# EAGLE schematic eCog_Buses_Template (EAGLE 6.6.0)
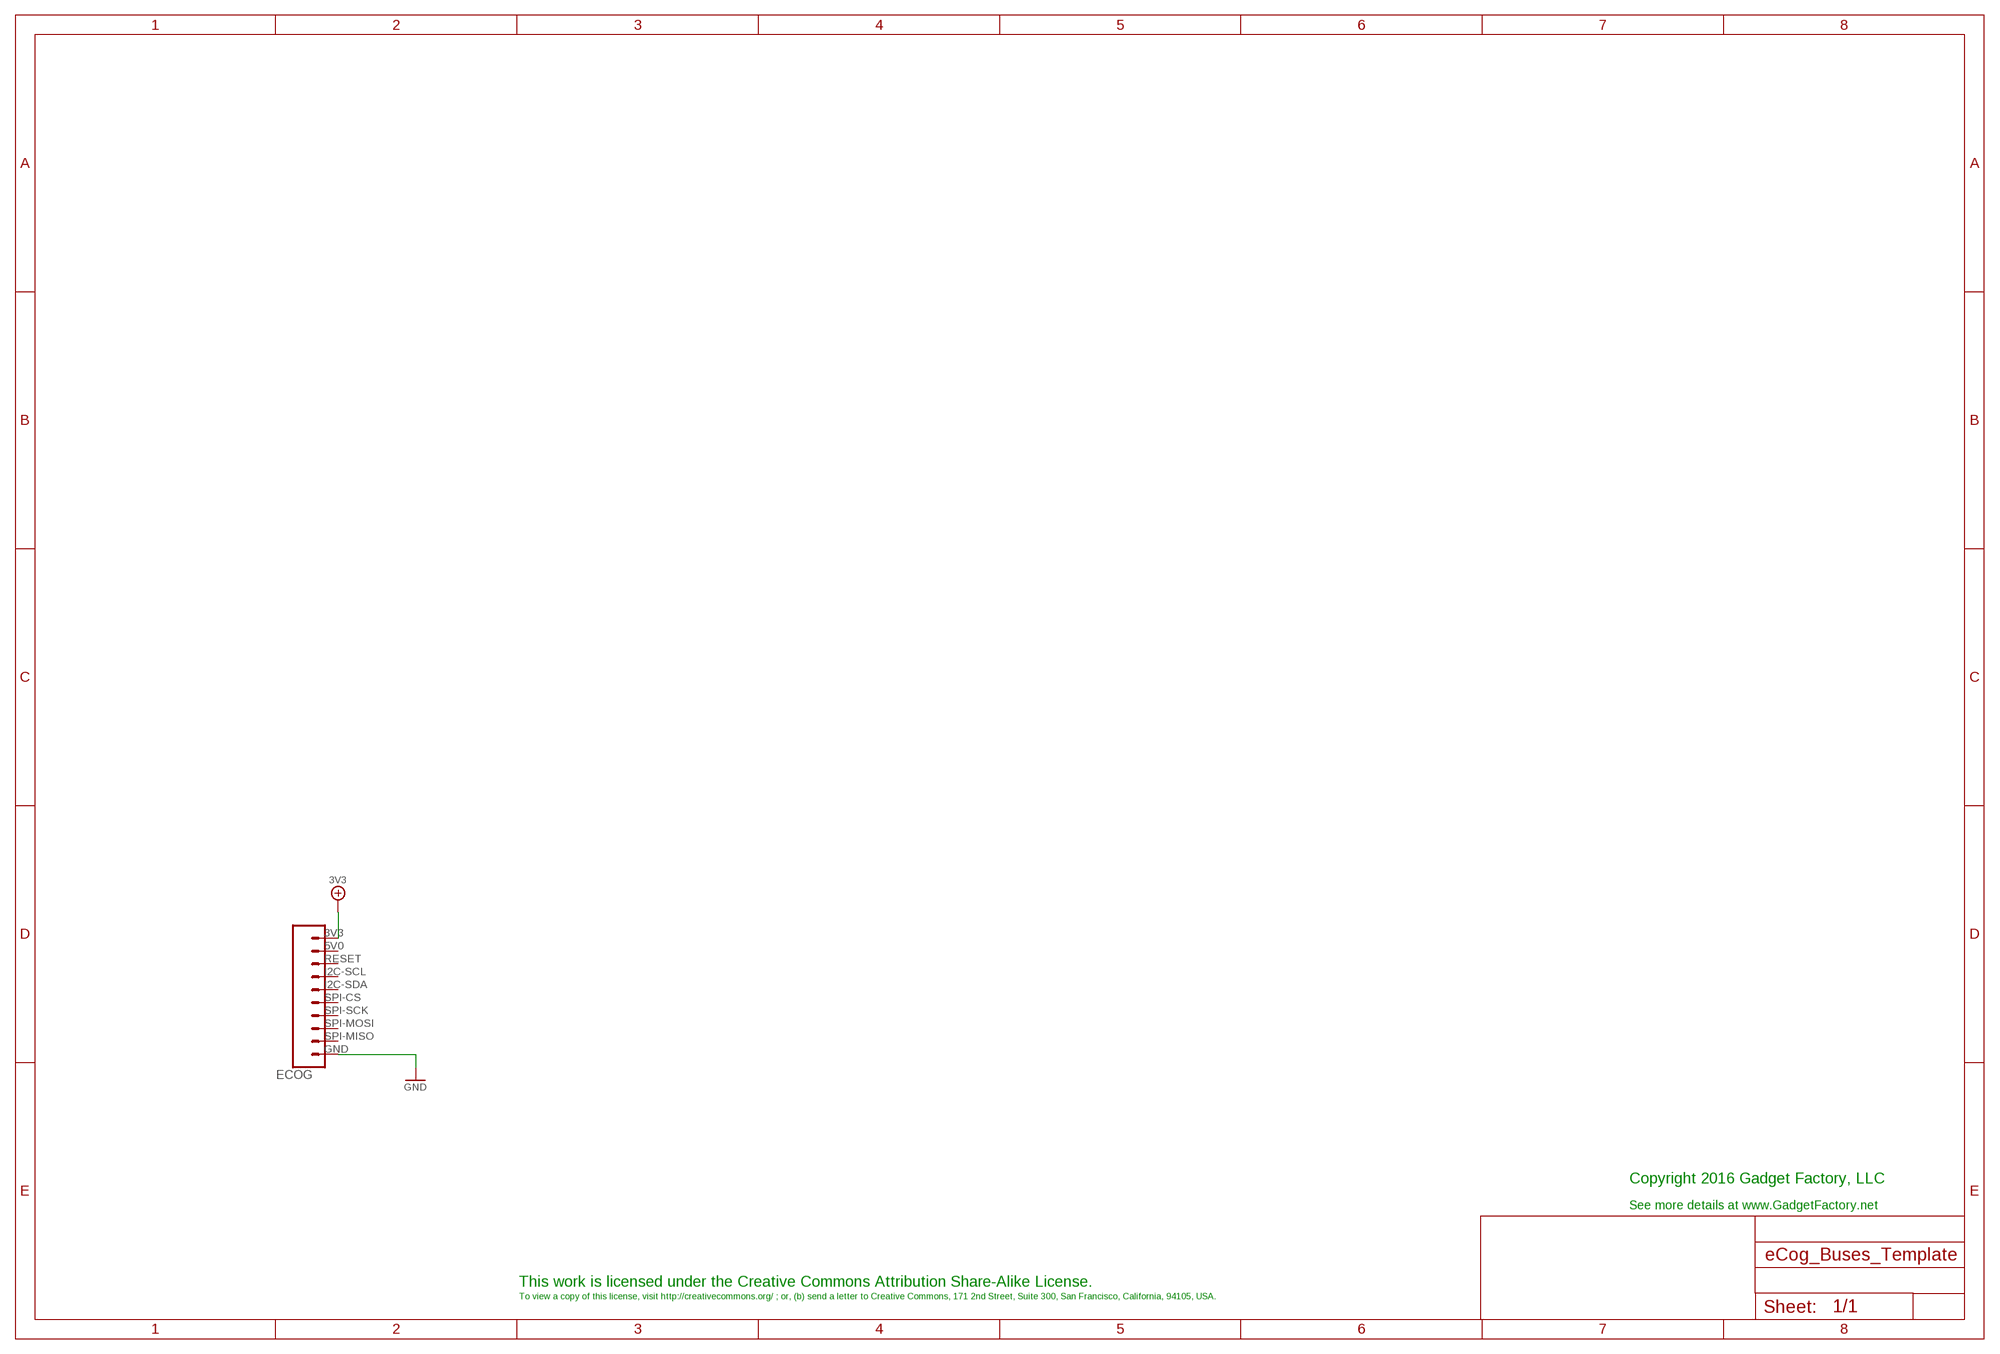
[diagram p0: schematic, sheet 1]

## Parts
ECOG  ECOG_BUSES_ROWTHROUGHHOLE  [ECOG_BUSES_TH]

## Nets
3V3: ECOG.3V3
GND: ECOG.GND
Unconnected: ECOG.5V0(RSV) ECOG.I2C-SCL ECOG.I2C-SDA ECOG.RESET(RSV) ECOG.SPI-CS ECOG.SPI-MISO ECOG.SPI-MOSI ECOG.SPI-SCK

## Notes on the sheet
- Copyright 2016 Gadget Factory, LLC
- See more details at www.GadgetFactory.net
- This work is licensed under the Creative Commons Attribution Share-Alike License.
- To view a copy of this license, visit http://creativecommons.org/ ; or, (b) send a letter to Creative Commons, 171 2nd Street, Suite 300, San Francisco, California, 94105, USA.

## Library data of the parts
ECOG = eCogs:ECOG_BUSES_ROW